# Altium schematic sheet Memory.SchDoc
size A4; SheetNumber: 3; SheetTotal: 3
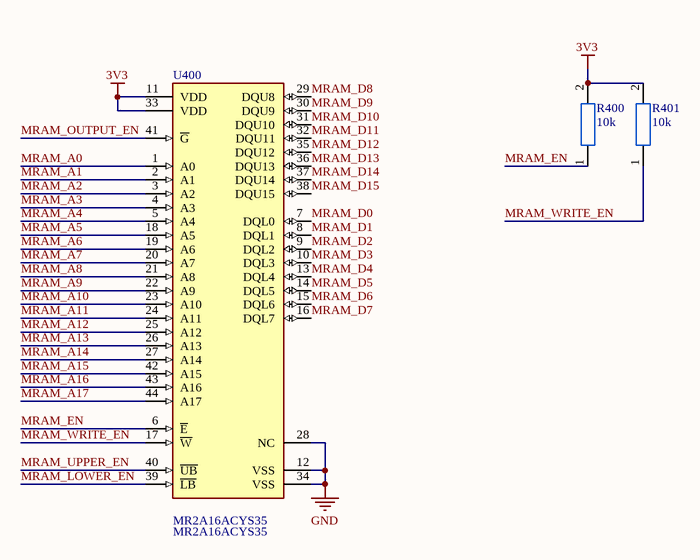
[diagram p0: Memory.SchDoc]

## Parts
R400  10k  [0402_footprint]
R401  10k  [0402_footprint]
U400  MR2A16ACYS35  [Everspin_MR2A16ACYS35_0]

## Nets
3V3: R400.2 R401.2 U400.11(VDD) U400.33(VDD)
GND: U400.12(VSS) U400.28(NC) U400.34(VSS)
MRAM_A0: U400.1(A0)
MRAM_A1: U400.2(A1)
MRAM_A2: U400.3(A2)
MRAM_A3: U400.4(A3)
MRAM_A4: U400.5(A4)
MRAM_A5: U400.18(A5)
MRAM_A6: U400.19(A6)
MRAM_A7: U400.20(A7)
MRAM_A8: U400.21(A8)
MRAM_A9: U400.22(A9)
MRAM_A10: U400.23(A10)
MRAM_A11: U400.24(A11)
MRAM_A12: U400.25(A12)
MRAM_A13: U400.26(A13)
MRAM_A14: U400.27(A14)
MRAM_A15: U400.42(A15)
MRAM_A16: U400.43(A16)
MRAM_A17: U400.44(A17)
MRAM_D0: U400.7(DQL0)
MRAM_D1: U400.8(DQL1)
MRAM_D2: U400.9(DQL2)
MRAM_D3: U400.10(DQL3)
MRAM_D4: U400.13(DQL4)
MRAM_D5: U400.14(DQL5)
MRAM_D6: U400.15(DQL6)
MRAM_D7: U400.16(DQL7)
MRAM_D8: U400.29(DQU8)
MRAM_D9: U400.30(DQU9)
MRAM_D10: U400.31(DQU10)
MRAM_D11: U400.32(DQU11)
MRAM_D12: U400.35(DQU12)
MRAM_D13: U400.36(DQU13)
MRAM_D14: U400.37(DQU14)
MRAM_D15: U400.38(DQU15)
MRAM_EN: R400.1 U400.6(~{E})
MRAM_LOWER_EN: U400.39(~{LB})
MRAM_OUTPUT_EN: U400.41(~{G})
MRAM_UPPER_EN: U400.40(~{UB})
MRAM_WRITE_EN: R401.1 U400.17(~{W})

## Library data of the parts
R400 R401 = Resistor_0402
U400 = CMP-003-000000-1: IC RAM 4M PARALLEL 44TSOP2; Manufacturer: Everspin; Value: SKIP; Access Time: 35ns; Max Supply Voltage: 3.6V; Memory Size: 512KB; Standoff Height: 0.05mm; Min Supply Voltage: 3V; Memory Type: OTHER; Nominal Supply Current: 55-105mA; Library Path1: parts/IC_Everspin_MR2A16ACYS35_eec.SchLib; Verification Version: 0.0.0.1; Mouser Description: NVRAM 4Mb 3.3V 35ns 256Kx16 Prallel MRAM; Part Number: MR2A16ACYS35; Temperature: -40°C to +85°C; Library Ref1: MR2A16ACYS35; Ambient Temperature Range High: +85°C; Ipc Land Pattern Name: SOP80P1176X120-44; Datasheet Path1: datasheets/IC_Everspin_MR2A16ACYS35_eec.pdf; Digikey Part Number: 819-1011-ND; Inductance: SKIP; ComponentLink1Description: Upverter; ComponentLink2Description: Datasheet; Capacitance: SKIP; Mouser Part Number: 936-MR2A16ACYS35; ComponentLink1URL: https://upverter.com/upn/revision/cb113664244501cf/; RoHS: TRUE; Voltage: SKIP; Price: SKIP; Height: 1.2mm; Ambient Temperature Range Low: -40°C; ComponentLink2URL: https://www.everspin.com/file/156628/download; Package: MR2A16ACYS35; Digikey Description: IC RAM 4M PARALLEL 44TSOP2; Temperature Range Low: -40°C; Resistance: SKIP; Interface: Parallel; Lead Free: yes; helpURL: https://upverter.com/upn/revision/cb113664244501cf/; Temperature Range High: +85°C; Datasheet Path: datasheets/IC_Everspin_MR2A16ACYS35_eec.pdf; ComponentLink3Description: Geresnis datasheet; ComponentLink3URL: https://eu.mouser.com/datasheet/2/144/MR2A16A_Datasheet-1511477.pdf